# Altium schematic sheet Sheet1.SchDoc
size A4; SheetNumber: 1; SheetTotal: 1; ENG_APP_DATE: --/--/--; DSN_APP_DATE: --/--/--; CHK_APP_DATE: --/--/--
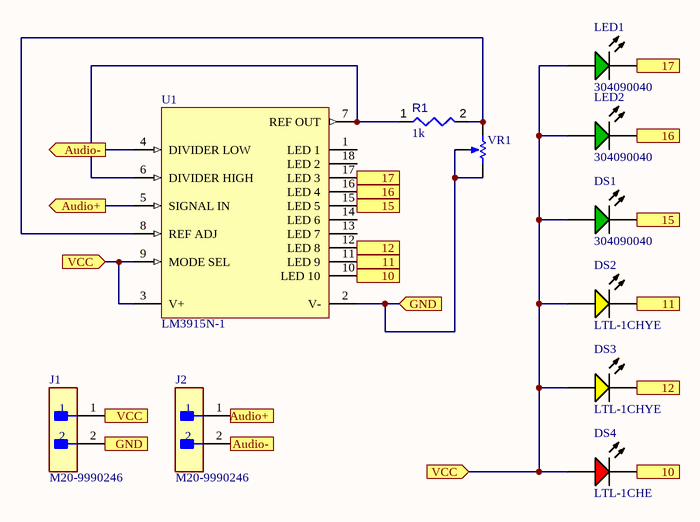
[diagram p0: Sheet1.SchDoc]

## Parts
DS1  304090040  [LED-2P-2.28-3MM]
DS2  LTL-1CHYE  [LTST-LTL-1CHYE]
DS3  LTL-1CHYE  [LTST-LTL-1CHYE]
DS4  LTL-1CHE  [INDPR60-254-520X380X650]
J1  M20-9990246  [FP-M20-9990246-MFG]
J2  M20-9990246  [FP-M20-9990246-MFG]
LED1  304090040  [LED-2P-2.28-3MM]
LED2  304090040  [LED-2P-2.28-3MM]
R1  value 1k  [RESA60-630X240]  (hidden comment: MFR-25FBF52-1K)
U1  LM3915N-1  [NFK0018A]
VR1  3362P-1-103LF  [BOUR-3362P]  (value not drawn)

## Ports
10 (in), 10 (out), 11 (in), 11 (out), 12 (in), 12 (out), 15 (in), 15 (out), 16 (in), 16 (out), 17 (in), 17 (out), Audio+, Audio+ (out), Audio-, Audio- (out), GND (in), GND (out), VCC (in), VCC (out)

## Nets
10: DS4.2(K) U1.10(LED_10) ; port 10
11: DS2.2(K) U1.11(LED_9) ; port 11
12: DS3.2(K) U1.12(LED_8) ; port 12
15: DS1.2(K) U1.15(LED_5) ; port 15
16: LED2.2(K) U1.16(LED_4) ; port 16
17: LED1.2(K) U1.17(LED_3) ; port 17
Audio+: J2.1 U1.5(SIGNAL_IN) ; port Audio+
Audio-: J2.2 U1.4(DIVIDER_LOW) ; port Audio-
GND: J1.2 U1.2(V-) VR1.2(S) VR1.3(CW) ; port GND
VCC: DS1.1(A) DS2.1(A) DS3.1(A) DS4.1(A) J1.1 LED1.1(A) LED2.1(A) U1.3(V+) U1.9(MODE_SEL) ; port VCC
NetR1_1: R1.1 U1.6(DIVIDER_HIGH) U1.7(REF_OUT)
NetR1_2: R1.2 U1.8(REF_ADJ) VR1.1(CCW)

Not connected (* = marked no-connect by the designer): U1 1(LED_1) 13(LED_7) 14(LED_6) 18(LED_2)

## Notes on the sheet
- Title
- Size:
- Date:
- A4
- Number:
- Time:
- Revision:
- Sheet
- of
- File:

## Library data of the parts
DS1 LED1 LED2 = CMP-007-00006-2: Green LED, 80 mW, 20 mA, -25 to 85 degC, 2-Pin THD; Manufacturer: Shenzhen CGX; Manufacturer URL: http://szcgx.com/; Package Reference: 304090040; Datasheet Version: Rev. 1.0, 09/2014; RoHS Compliant: Unknown; Case/Package: 304090040; Package Description: 2-Pin Through Hole Device, Dia 3 mm, Pitch 2.28 mm; Datasheet URL: http://datasheet.octopart.com/304090040-Chengguangxing-datasheet-62330655.pdf; Mounting Technology: TH
DS2 DS3 = CMP-007-00020-2: LED Uni-Color Yellow, 60 mW, 20 mA, -55 to 100 degC, 2-Pin THD, RoHS, Bulk; Manufacturer: Lite-On; Nominal Vf: 2.1V; Luminous Intensity: 40mcd; Lens Style: Dome; Forward Current: 20mA; Viewing Angle: 45degrees; Max Operating Temperature: 100°C; Case/Package: Radial; Min Operating Temperature: -55°C; Colour: Yellow; Datasheet Version: Rev. B, 07/2013; Packaging: Bulk; Illumination Colour: Yellow; Package Quantity: 1000; Pins: 2; Package Reference: LTL-1CHYE; Forward Voltage: 2.1V; Mounting Technology: TH; Datasheet URL: https://datasheet.ciiva.com/4269/s-110-ltl-1chye-4269126.pdf; RoHS Compliant: True; Package Description: 2-Pin Through Hole Device, Dia 3.8 mm, Pitch 2.54 mm; Manufacturer URL: http://www.us.liteon.com/
DS4 = CMP-007-00018-2: LED Uni-Color Red, 100 mW, 30 mA, -55 to 100 degC, 2-Pin THD, RoHS, Bulk; Manufacturer: Lite-On; Forward Current: 20mA; Nominal Vf: 2V; Viewing Angle: 60degrees; Luminous Intensity: 12.6mcd; Lens Style: Dome; Pins: 2; RoHS Compliant: True; Package Reference: LTL-1CHE; Package Quantity: 1000; Mounting Technology: TH; Min Operating Temperature: -55°C; Colour: Red; Case/Package: Radial; Manufacturer URL: http://www.us.liteon.com/; Datasheet URL: https://datasheet.ciiva.com/15117/getdatasheetpartid-187746-15117985.pdf; Forward Voltage: 2V; Max Operating Temperature: 100°C; Illumination Colour: Red; Package Description: 2-Pin Through Hole Device, Dia 3.8 mm, Pitch 2.54 mm; Packaging: Bulk; Datasheet Version: Dec-03
J1 J2 = CMP-15831-000009-1: CONN HEADER VERT 2POS 2.54MM; Manufacturer: Harwin; Conn Gender: Male; Description: Connector Header Through Hole 2 position 0.100" (2.54mm); Conn Orientation: Vertical; Number Of Contacts: 2; Current Rating: 3A; ComponentLink2URL: https://cdn.harwin.com/pdfs/M20-999.pdf; ComponentLink2Description: Datasheet; Package: M20-9990246; Temperature: -40°C to +105°C; Octopart: https://octopart.com/m20-9990246-harwin-2590635; Mouser Description: 2.54mm (0.1") Pitch SIL Vertical PC Tail Pin Header, 6.1mm mating pin height, tin, 2 contacts; Temperature Range High: +105°C; Device Class L1: Connectors; RoHS: TRUE; Automotive: No; Height: 8.99mm; Number Of Rows: 1; Contact Material: Tin,Nickel; Category: Conn; Pitch: 2.54mm; Lead Free: Yes; Digikey Description: CONN HEADER VERT 2POS 2.54MM; Manufacturer Part Number: M20-9990246; Temperature Range Low: -40°C; Device Class L3: unset; Device Class L2: Headers and Wire Housings
R1 = CMP-009-00048-4: Axial Resistor, 1 KOhm, +/- 1%, 250 mW, -55 to 155 degC, 2-Pin THD, RoHS, Bulk; Manufacturer: Yageo; Voltage Rating: 250V; Power: 250mW; Min Operating Temperature: -55°C; Max Operating Temperature: 155°C; Tolerance: 1%; Package Reference: MFR-25; Composition: CarbonFilm; Mounting Technology: TH; Packaging: Bulk; Case/Package: Axial; Datasheet URL: http://www.yageo.com/documents/recent/Yageo%20LR_MFR_2013.pdf; Package Quantity: 200; Manufacturer URL: http://www.yageo.com/; Package Description: 2-Pin Axial Lead, Dia 2.4 mm, Body Length 6.3 mm; Datasheet Version: Apr-13; RoHS Compliant: True
U1 = CMP-0058-00005-3: Dot/Bar Display Driver, 18-pin MDIP; Manufacturer: Texas Instruments; CompType: Audio IC; PackageTopMarking: NSUZXYYTTE#*LM3915N-1; PowerWise: N; Code_JEDEC: MS-001-AC; ComponentLink1Description: Datasheet URL; RoHS: N; PackageDescription: MDIP, .900 x .250 x .155in, 18 Lead, .100in Pitch; ComponentLink1URL: http://www.ti.com/general/docs/lit/getliterature.tsp?genericPartNumber=LM3915&fileType=pdf; PinCount: 18; PackageReference: NFK0018A
VR1 = CMP-009-00039-2: Square Trimpot(R) Trimming Potentiometer, 10 KOhm, 300 V, -55 to 125 degC, 3-Pin THD, RoHS, Tube; Manufacturer: Bourns; Tolerance: 10%; Power: 500mW; Voltage Rating: 300V; Resistance: 10k; Packaging: Rail/Tube; Package Reference: 3326P; Manufacturer URL: http://www.bourns.com/; Composition: Potentiometer; Package Description: 3-Pin Through Hole Device, Body 6.6 x 6.99 mm, Pitch 2.54 mm; Max Operating Temperature: 125°C; Min Operating Temperature: -55°C; Datasheet Version: May-16; Lead Pitch: 2.54mm; Pins: 3; Datasheet URL: http://www.bourns.com/docs/Product-Datasheets/3362.pdf; Package Quantity: 250; Case/Package: 3326P; RoHS Compliant: True; Mounting Technology: TH